# EAGLE design mini-usb-con (EAGLE 9.2.0)
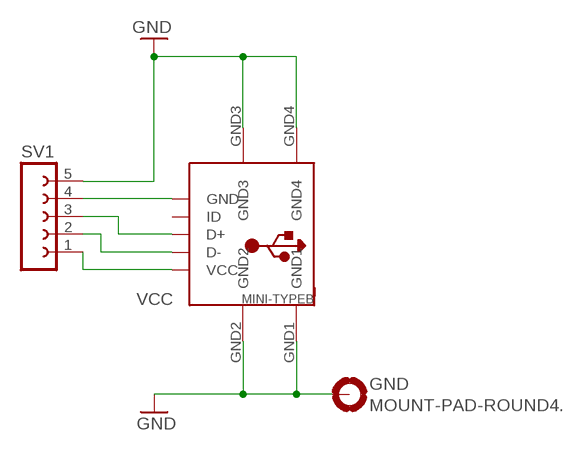
[diagram p0: schematic, sheet 1]

## Parts
GND  MOUNT-PAD-ROUND4.1  [4,1-PAD]
MINI-TYPEB  USBTHM  [USB-MINIB-THM]
SV1  FE05-1  [FE05-1]

## Nets
D+: MINI-TYPEB.D+ SV1.3
D-: MINI-TYPEB.D- SV1.2
GND1: GND.B4,1(MOUNT) MINI-TYPEB.GND1 MINI-TYPEB.GND2 MINI-TYPEB.GND3 MINI-TYPEB.GND4 SV1.5 ; supply symbol labelled GND
N$1: MINI-TYPEB.GND SV1.4
VCC: MINI-TYPEB.VCC SV1.1
Unconnected: MINI-TYPEB.ID

## Library data of the parts
GND = con-haxn:MOUNT-PAD-ROUND: MOUNTING PAD, round
MINI-TYPEB = con-haxn:USB: USB Connectors USBMINIB - Surface Mount Female Mini-B USB Connector 4UConnector: 06564 By microbuilder.eu Thru-hole RA Female Mini-B USB Connector 4UConnector: 18732 By ladyada.net
SV1 = con-lsta:FE05-1: FEMALE HEADER; OC_FARNELL: unknown; OC_NEWARK: unknown

## Board
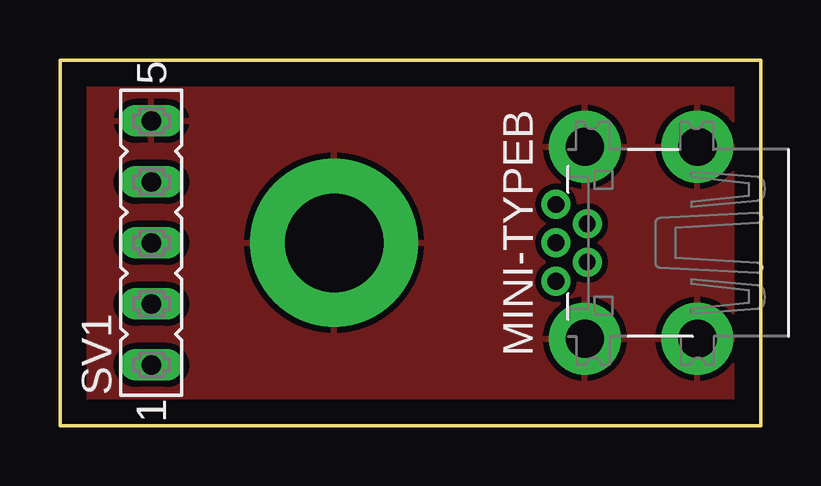
[diagram p1: board, top side]
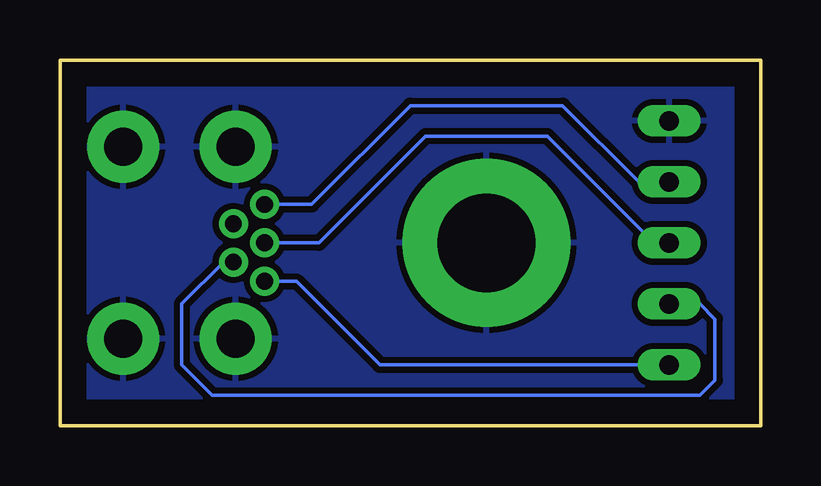
[diagram p2: board, bottom side, seen from below]

Size 29.21 x 15.24 mm. Coordinates in mm from the lower left corner, seen from the top.
Outline: 0,15.24 0,0 29.21,0 29.21,15.24 0,15.24
Copper layers (1*16): Top 0.035mm / dielectric 1.5mm / Bottom 0.035mm
Design rules "default": minimum track width 6mil, minimum drill 0.35mm, track to track 6mil, track to pad 6mil, pad to pad 6mil, via to via 6mil, smd to smd 6mil, copper to edge 40mil, drill to drill 6mil, minimum pad ring 10mil, minimum via ring 8mil, stop-mask expansion 4mil, vias tented up to drill 0mil, thermal gap 10mil

### Footprints (pad centres in the part's own frame; a part is rotated, then mirrored left to right if it is on the bottom)
4,1-PAD = drill 4.1 pad 7: B4,1 0,0
USB-MINIB-THM = drill 0.7: D+ 0,9.8; D- -0.8,8.5; GND 1.6,9.8; ID 0.8,8.5; VCC -1.6,9.8 | drill 1.59 pad 3: GND1 -4,3.9; GND2 -4,8.6; GND3 4,8.6; GND4 4,3.9
FE05-1 = drill 0.813 long: 1 -5.08,0; 2 -2.54,0; 3 0,0; 4 2.54,0; 5 5.08,0

### Placement (x,y rotation side)
GND  11.43,7.62 0 top
MINI-TYPEB  30.48,7.62 90 top
SV1  3.81,7.62 90 top

### Tracks (layer width: path | path; a pad name or v marks a point on that pad's centre or on a via)
D+
  Bottom 0.152: SV1.3 4.45,7.62 8.89,12.07 13.97,12.07 18.41,7.62 MINI-TYPEB.D+
D-
  Bottom 0.152: MINI-TYPEB.D- 22.39,6.82 24.13,5.08 24.13,2.54 22.86,1.27 2.54,1.27 1.91,1.91 1.91,4.45 2.54,5.08 SV1.2
GND1
  pour Bottom (isolate 0.254): 0,15.24 0,0 29.21,0 29.21,15.24
  pour Top (isolate 0.254): 29.21,0 0,0 0,15.24 29.21,15.24
N$1
  Bottom 0.152: MINI-TYPEB.GND 18.72,9.22 14.61,13.34 8.25,13.34 5.08,10.16 SV1.4
VCC
  Bottom 0.152: MINI-TYPEB.VCC 19.36,6.02 15.88,2.54 SV1.1

### Text on the board
tDocu: Shield GND | GND | D+ | D- | VCC